# Altium schematic sheet SRK1201L_MODUL_CON.SCHDOC
size A4
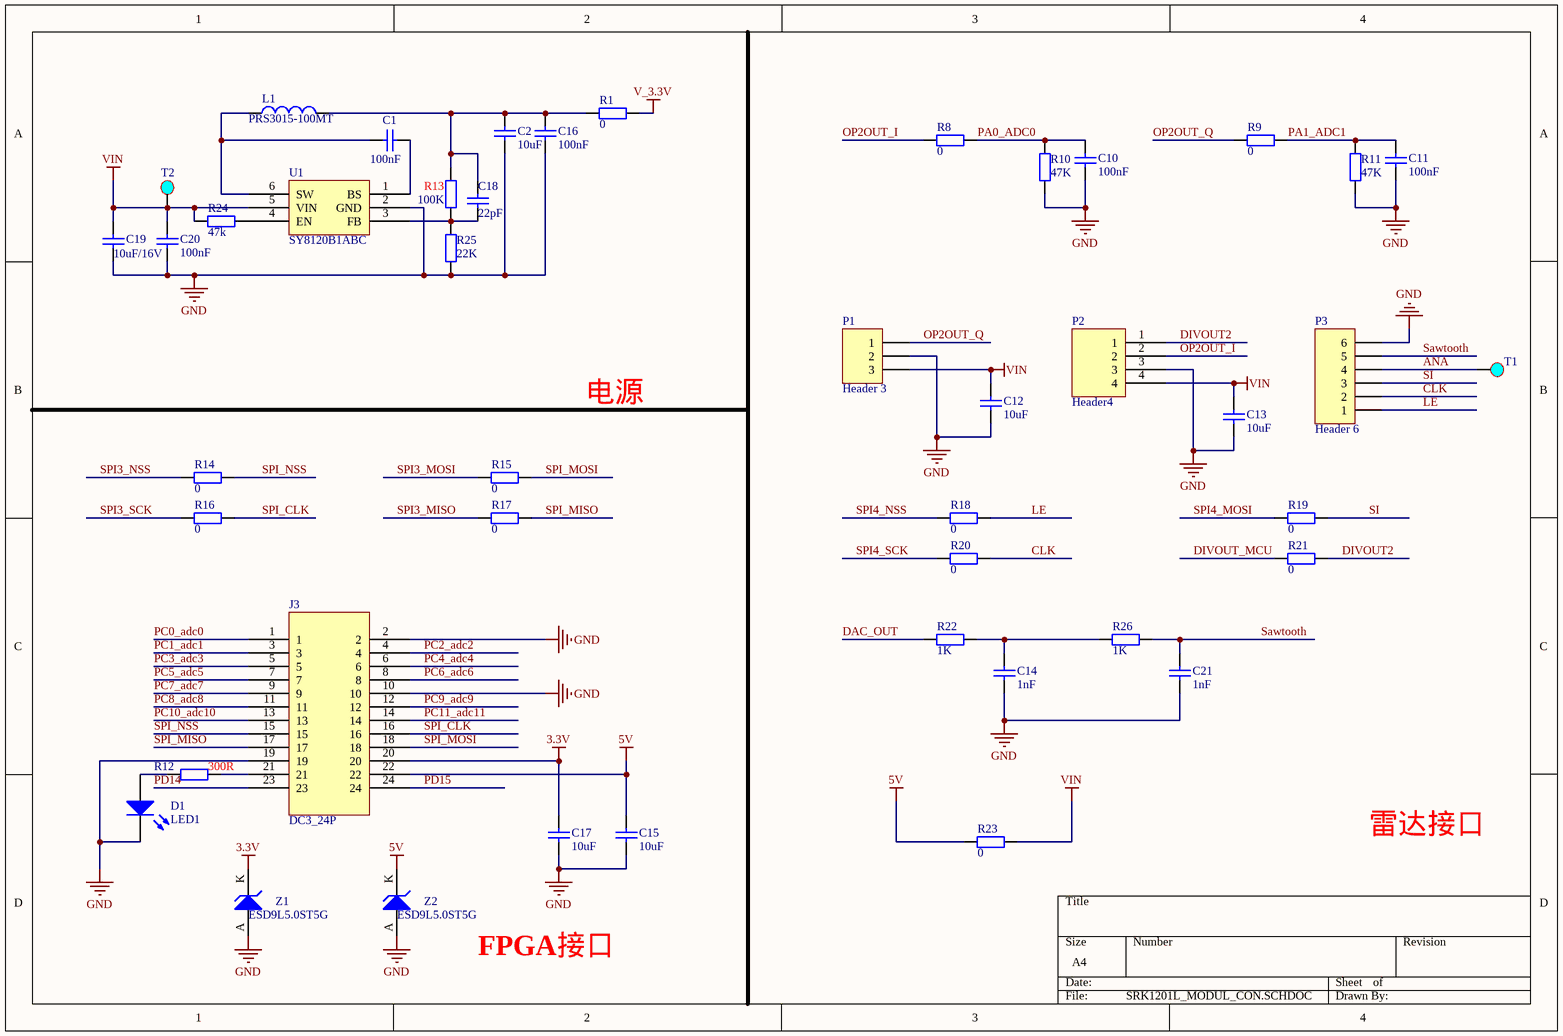
[diagram p0: SRK1201L_MODUL_CON.SCHDOC]

## Parts
C1  100nF  [C0402]
C2  10uF  [C0603]
C10  100nF  [C0402]
C11  100nF  [C0402]
C12  10uF  [C0603]
C13  10uF  [C0603]
C14  1nF  [C0402]
C15  10uF  [C0603]
C16  100nF  [C0402]
C17  10uF  [C0603]
C18  22pF  [C0402]
C19  10uF/16V  [C0603]
C20  100nF  [C0402]
C21  1nF  [C0402]
D1  LED1  [LED-0603]
J3  DC3_24P  [CON2.0-12X2 -SWAP]
L1  PRS3015-100MT  [PRS3015]
P1  Header 3  [HDR1X3-2.54]
P2  Header4  [J4]
P3  Header 6  [HDR1X6]
R1  0  [R0402]
R8  0  [R0402]
R9  0  [R0402]
R10  47K  [R0402]
R11  47K  [R0402]
R12  300R  [R0402]
R13  100K  [R0402]
R14  0  [R0402]
R15  0  [R0402]
R16  0  [R0402]
R17  0  [R0402]
R18  0  [R0402]
R19  0  [R0402]
R20  0  [R0402]
R21  0  [R0402]
R22  1K  [R0402]
R23  0  [R0402]
R24  47k  [R0402]
R25  22K  [R0402]
R26  1K  [R0402]
T1  (no value)  [TestPoints]
T2  (no value)  [TestPoints-0.7]
U1  SY8120B1ABC  [SOT-23-6]
Z1  ESD9L5.0ST5G  [SOD-923]
Z2  ESD9L5.0ST5G  [SOD-923]

## Nets
3.3V: C17.1 J3.20 Z1.K
5V: C15.1 J3.22 R23.2 Z2.K
GND: C2.2 C10.2 C11.2 C12.2 C13.2 C14.2 C15.2 C16.1 C17.2 C19.2 C20.1 C21.2 D1.2(K) J3.2 J3.10 J3.19 P1.2 P2.3 P3.6 R10.1 R11.1 R25.1 U1.2(GND) Z1.A Z2.A
V_3.3V: R1.1
VIN: C12.1 C13.1 C19.1 C20.2 P1.3 P2.4 R23.1 R24.2 T2.1 U1.5(VIN)
ANA: P3.4 T1.1
CLK: P3.2 R20.1
DAC_OUT: R22.2
DIVOUT2: P2.1 R21.1
DIVOUT_MCU: R21.2
LE: P3.1 R18.1
OP2OUT_I: P2.2 R8.2
OP2OUT_Q: P1.1 R9.2
PA0_ADC0: C10.1 R8.1 R10.2
PA1_ADC1: C11.1 R9.1 R11.2
PC0_adc0: J3.1
PC1_adc1: J3.3
PC2_adc2: J3.4
PC3_adc3: J3.5
PC4_adc4: J3.6
PC5_adc5: J3.7
PC6_adc6: J3.8
PC7_adc7: J3.9
PC8_adc8: J3.11
PC9_adc9: J3.12
PC10_adc10: J3.13
PC11_adc11: J3.14
PD14: J3.23
PD15: J3.24
Sawtooth: C21.1 P3.5 R26.1
SI: P3.3 R19.1
SPI3_MISO: R17.2
SPI3_MOSI: R15.2
SPI3_NSS: R14.2
SPI3_SCK: R16.2
SPI4_MOSI: R19.2
SPI4_NSS: R18.2
SPI4_SCK: R20.2
SPI_CLK: J3.16 R16.1
SPI_MISO: J3.17 R17.1
SPI_MOSI: J3.18 R15.1
SPI_NSS: J3.15 R14.1
NetC1_1: C1.1 L1.1 U1.6(SW)
NetC1_2: C1.2 U1.1(BS)
NetC2_1: C2.1 C16.2 C18.2 L1.2 R1.2 R13.2
NetC14_1: C14.1 R22.1 R26.2
NetC18_1: C18.1 R13.1 R25.2 U1.3(FB)
NetD1_1: D1.1(A) R12.2
NetJ3_21: J3.21 R12.1
NetR24_1: R24.1 U1.4(EN)

## Notes on the sheet
- 电源
- 雷达接口
- FPGA接口

## Library data of the parts
C1 C2 C10-C21 = Cap: Capacitor; Published: 8-Jun-2000; LatestRevisionDate: 17-Jul-2002; LatestRevisionNote: Re-released for DXP Platform.; PackageReference: RAD-0.3; Publisher: Altium Limited; PackageDescription: Radial Cap, Thru-Hole; 2 Leads; 0.3 in Pin Spacing
  C1 C10 C11 C16 C20: Value: 100nF
  C2 C12 C13 C15 C17: Value: 10uF
  C14 C21: Value: 1nF
  C18: Value: 22pF
  C19: Value: 10uF/16V
D1 = LED1: Typical RED GaAs LED; Published: 8-Jun-2000; LatestRevisionDate: 08-Jul-2005; LatestRevisionNote: Mech Layer 1 removed.; PackageReference: LED-1; Publisher: Altium Limited; PackageDescription: LED; 2 Leads
L1 = Inductor: Code_IEC: 1005; Published: 8-Jun-2000; LatestRevisionDate: 29-May-2009; LatestRevisionNote: IPC-7351 Footprint Added.; PackageReference: 0402-A; Publisher: Altium Limited; PackageDescription: Chip Inductor; Code_JEITA: 0402; Value: PRS3015-100MT
P1 = Header 3: Header, 3-Pin; LatestRevisionDate: 17-Jul-2002; LatestRevisionNote: Re-released for DXP Platform.; Publisher: Altium Limited
P2 = J4
P3 = Header 6: Header, 6-Pin; LatestRevisionDate: 17-Jul-2002; LatestRevisionNote: Re-released for DXP Platform.; Publisher: Altium Limited
R1 R8-R26 = Res2: Resistor; Published: 8-Jun-2000; LatestRevisionDate: 17-Jul-2002; LatestRevisionNote: Re-released for DXP Platform.; PackageReference: AXIAL-0.4; Publisher: Altium Limited; PackageDescription: Axial Device, Thru-Hole; 2 Leads; 0.4 in Pin Spacing
  R1 R8 R9 R14-R21 R23: Value: 0
  R10 R11: Value: 47K
  R12: Value: 300R
  R13: Value: 100K
  R22 R26: Value: 1K
  R24: Value: 47k
  R25: Value: 22K
T1 T2 = TestPoints
U1 = H9108
Z1 Z2 = D Zener: Zener Diode; Published: 8-Jun-2000; LatestRevisionDate: 17-Jul-2002; LatestRevisionNote: Re-released for DXP Platform.; PackageReference: DIODE-0.7; Publisher: Altium Limited; PackageDescription: Diode, Thru-Hole; 2 Leads; 0.7 in Pin Spacing